# Altium schematic sheet Controller.SchDoc
size A
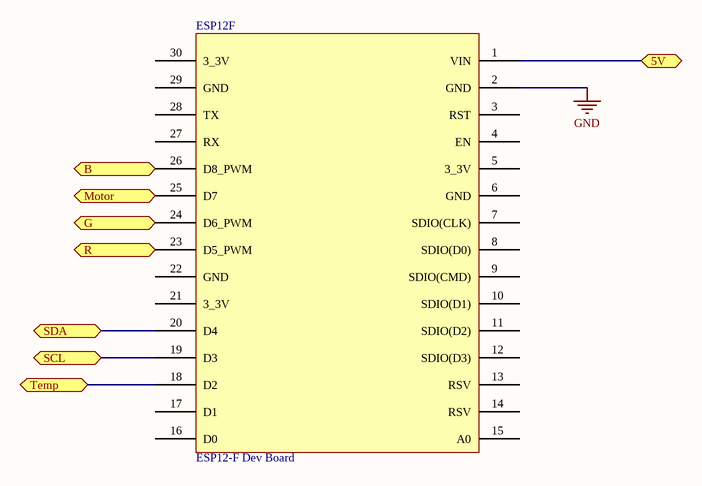
[diagram p0: Controller.SchDoc]

## Parts
ESP12F  ESP12-F Dev Board  [PCB-z8aaw0yugxv87lcq77q0-1]

## Ports
5V, B, G, Motor, R, SCL, SDA (bidir), Temp

## Nets
GND: ESP12F.2(GND)
5V: ESP12F.1(VIN) ; port 5V
B: ESP12F.26(D8_PWM) ; port B
G: ESP12F.24(D6_PWM) ; port G
Motor: ESP12F.25(D7) ; port Motor
R: ESP12F.23(D5_PWM) ; port R
SCL: ESP12F.19(D3) ; port SCL
SDA: ESP12F.20(D4) ; port SDA
Temp: ESP12F.18(D2) ; port Temp

Not connected (* = marked no-connect by the designer): ESP12F 3(RST) 4(EN) 5(3_3V) 6(GND) 7(SDIO(CLK)) 8(SDIO(D0)) 9(SDIO(CMD)) 10(SDIO(D1)) 11(SDIO(D2)) 12(SDIO(D3)) 13(RSV) 14(RSV) 15(A0) 16(D0) 17(D1) 21(3_3V) 22(GND) 27(RX) 28(TX) 29(GND) 30(3_3V)

## Library data of the parts
ESP12F = CMP-sxw3ufcwmxs35hbw3bea-6: Board for the ESP12-F module made by Doit.am; Homepage URL: https://github.com/SmartArduino/SZDOITWiKi/wiki/ESP8266---ESP-F